# EAGLE schematic booz_main (EAGLE 6.1)

## Sheet 1 of 3
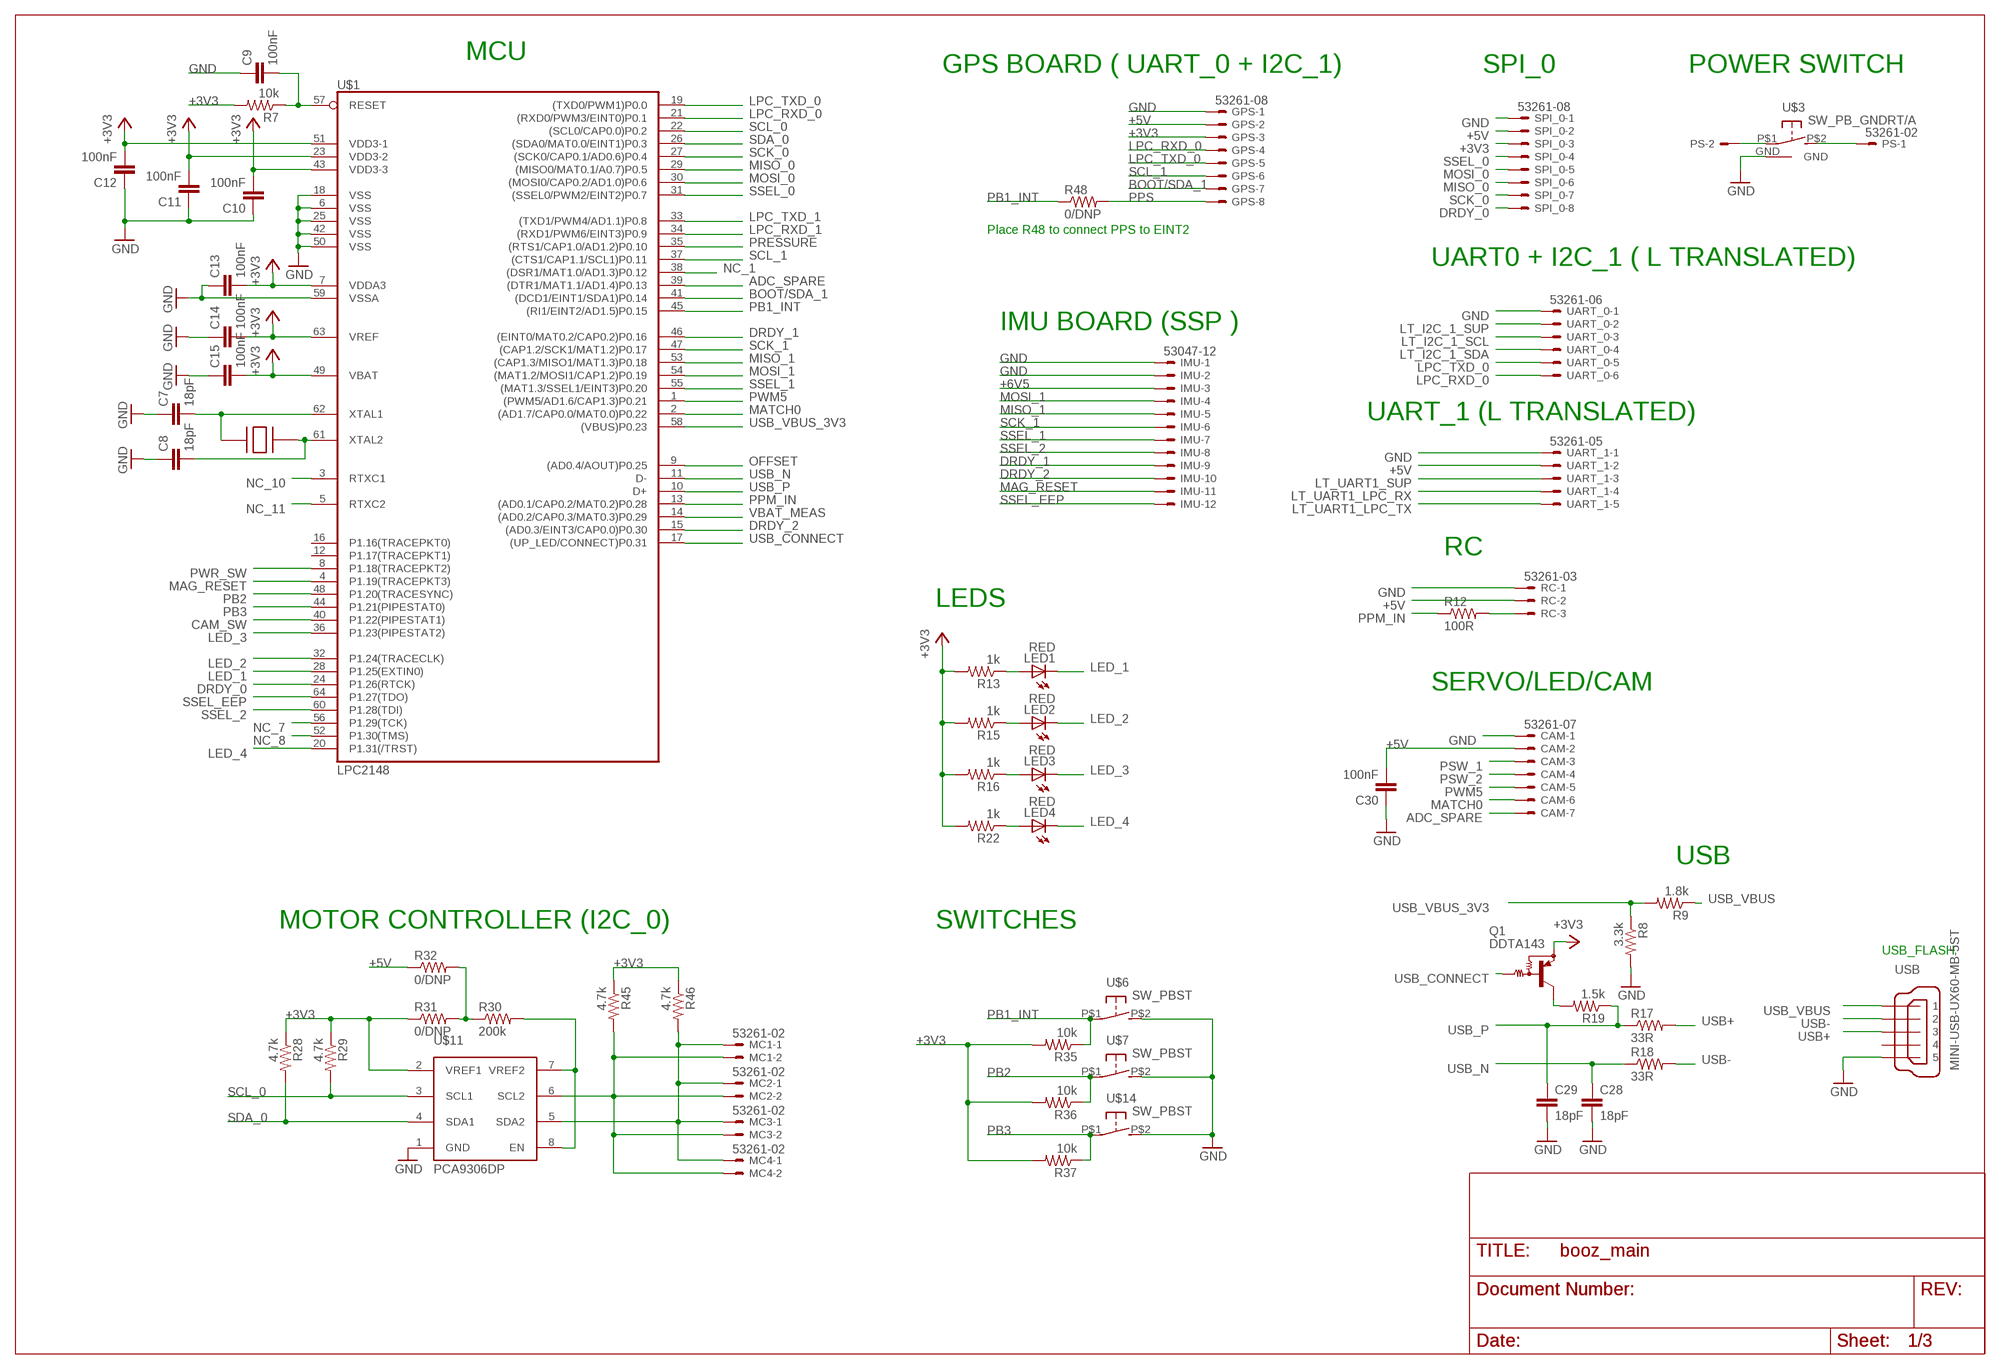
[diagram p0: schematic, sheet 1]

### Parts
C7  18pF  C-EUC0603  [C0603]
C8  18pF  C-EUC0603  [C0603]
C9  100nF  C-EUC0603  [C0603]
C10  100nF  C-EUC0603  [C0603]
C11  100nF  C-EUC0603  [C0603]
C12  100nF  C-EUC0603  [C0603]
C13  100nF  C-EUC0603  [C0603]
C14  100nF  C-EUC0603  [C0603]
C15  100nF  C-EUC0603  [C0603]
C28  18pF  C-EUC0603  [C0603]
C29  18pF  C-EUC0603  [C0603]
C30  100nF  C-EUC0603  [C0603]
CAM  53261-07  [53261-07]
GPS  53261-08  [53261-08]
IMU  53047-12  [53047-12]
LED1  RED  LEDCHIP-LED0805  [CHIP-LED0805]
LED2  RED  LEDCHIP-LED0805  [CHIP-LED0805]
LED3  RED  LEDCHIP-LED0805  [CHIP-LED0805]
LED4  RED  LEDCHIP-LED0805  [CHIP-LED0805]
MC1  53261-02  [53261-02]
MC2  53261-02  [53261-02]
MC3  53261-02  [53261-02]
MC4  53261-02  [53261-02]
PS  53261-02  [53261-02]
Q1  DDTA143  MUN2111T1  [SC59-BEC]
R7  10k  R-US_R0603  [R0603]
R8  3.3k  R-US_R0603  [R0603]
R9  1.8k  R-US_R0603  [R0603]
R12  100R  R-US_R0603  [R0603]
R13  1k  R-US_R0603  [R0603]
R15  1k  R-US_R0603  [R0603]
R16  1k  R-US_R0603  [R0603]
R17  33R  R-US_R0603  [R0603]
R18  33R  R-US_R0603  [R0603]
R19  1.5k  R-US_R0603  [R0603]
R22  1k  R-US_R0603  [R0603]
R28  4.7k  R-US_R0603  [R0603]
R29  4.7k  R-US_R0603  [R0603]
R30  200k  R-US_R0603  [R0603]
R31  0/DNP  R-US_R0603  [R0603]
R32  0/DNP  R-US_R0603  [R0603]
R35  10k  R-US_R0603  [R0603]
R36  10k  R-US_R0603  [R0603]
R37  10k  R-US_R0603  [R0603]
R45  4.7k  R-US_R0603  [R0603]
R46  4.7k  R-US_R0603  [R0603]
R48  0/DNP  R-US_R0603  [R0603]
RC  53261-03  [53261-03]
SPI_0  53261-08  [53261-08]
U$1  LPC2148  [SQFP-S-10X10-64]
U$3  SW_PB_GNDRT/A  [B3U-3100P]
U$4  CRYSTAL_CTS  [CTS_CRYSTAL]
U$6  SW_PBST  [B3U-1000P]
U$7  SW_PBST  [B3U-1000P]
U$11  PCA9306DP  [TSSOP_B3]
U$14  SW_PBST  [B3U-1000P]
UART_0  53261-06  [53261-06]
UART_1  53261-05  [53261-05]
USB  MINI-USB-UX60-MB-5ST  [UX60-MB-5ST]

### Nets
+3V3: C10.2 C11.2 C12.2 C13.2 C14.2 C15.2 GPS.3 Q1.E R7.2 R13.2 R15.2 R16.2 R22.2 R28.1 R29.1 R31.1 R35.2 R36.2 R37.2 R45.1 R46.1 SPI_0.3 U$1.7(VDDA3) U$1.23(VDD3-2) U$1.43(VDD3-3) U$1.49(VBAT) U$1.51(VDD3-1) U$1.63(VREF) U$11.2(VREF1) ; also sheet 2,3
+5V: C30.2 CAM.2 GPS.2 R32.1 RC.2 SPI_0.2 UART_1.2 ; also sheet 2,3
+6V5: IMU.3 ; also sheet 2
ADC_SPARE: CAM.7 U$1.39((DTR1/MAT1.1/AD1.4)P0.13)
BOOT/SDA_1: GPS.7 U$1.41((DCD1/EINT1/SDA1)P0.14) ; also sheet 3
CAM_SW: U$1.40(P1.22(PIPESTAT1)) ; also sheet 2
DRDY_0: SPI_0.8 U$1.24(P1.26(RTCK))
DRDY_1: IMU.9 U$1.46((EINT0/MAT0.2/CAP0.2)P0.16)
DRDY_2: IMU.10 U$1.15((AD0.3/EINT3/CAP0.0)P0.30)
GND: C7.1 C8.1 C9.1 C10.1 C11.1 C12.1 C13.1 C14.1 C15.1 C28.2 C29.2 C30.1 CAM.1 GPS.1 IMU.1 IMU.2 R8.2 RC.1 SPI_0.1 U$1.6(VSS) U$1.18(VSS) U$1.25(VSS) U$1.42(VSS) U$1.50(VSS) U$1.59(VSSA) U$3.GND U$6.P$2(S) U$7.P$2(S) U$11.1(GND) U$14.P$2(S) UART_0.1 UART_1.1 USB.5 ; also sheet 2,3
LED_1: LED1.C U$1.28(P1.25(EXTIN0))
LED_2: LED2.C U$1.32(P1.24(TRACECLK))
LED_3: LED3.C U$1.36(P1.23(PIPESTAT2))
LED_4: LED4.C U$1.20(P1.31(/TRST))
LPC_RESET: C9.2 R7.1 U$1.57(RESET)
LPC_RXD_0: GPS.4 U$1.21((RXD0/PWM3/EINT0)P0.1) UART_0.6
LPC_RXD_1: U$1.34((RXD1/PWM6/EINT3)P0.9) ; also sheet 3
LPC_TXD_0: GPS.5 U$1.19((TXD0/PWM1)P0.0) UART_0.5
LPC_TXD_1: U$1.33((TXD1/PWM4/AD1.1)P0.8) ; also sheet 3
LT_I2C_1_SCL: UART_0.3 ; also sheet 3
LT_I2C_1_SDA: UART_0.4 ; also sheet 3
LT_I2C_1_SUP: UART_0.2 ; also sheet 3
LT_UART1_LPC_RX: UART_1.4 ; also sheet 3
LT_UART1_LPC_TX: UART_1.5 ; also sheet 3
LT_UART1_SUP: UART_1.3 ; also sheet 3
MAG_RESET: IMU.11 U$1.4(P1.19(TRACEPKT3))
MATCH0: CAM.6 U$1.2((AD1.7/CAP0.0/MAT0.0)P0.22)
MISO_0: SPI_0.6 U$1.29((MISO0/MAT0.1/A0.7)P0.5)
MISO_1: IMU.5 U$1.53((CAP1.3/MISO1/MAT1.3)P0.18)
MOSI_0: SPI_0.5 U$1.30((MOSI0/CAP0.2/AD1.0)P0.6)
MOSI_1: IMU.4 U$1.54((MAT1.2/MOSI1/CAP1.2)P0.19)
N$1: LED1.A R13.1
N$2: C7.2 U$1.62(XTAL1) U$4.P$1
N$3: R30.1 R31.2 R32.2
N$4: C8.2 U$1.61(XTAL2) U$4.P$3
N$6: LED2.A R15.1
N$7: LED3.A R16.1
N$11: R30.2 U$11.7(VREF2) U$11.8(EN)
N$12: PS.2 U$3.P$1(P)
N$13: PS.1 U$3.P$2(S)
N$14: Q1.C R19.2
N$15: R12.2 RC.3
N$16: LED4.A R22.1
NC_1: U$1.38((DSR1/MAT1.0/AD1.3)P0.12)
NC_7: U$1.56(P1.29(TCK))
NC_8: U$1.52(P1.30(TMS))
NC_10: U$1.3(RTXC1)
NC_11: U$1.5(RTXC2)
OFFSET: U$1.9((AD0.4/AOUT)P0.25) ; also sheet 3
PB1_INT: R35.1 R48.1 U$1.45((RI1/EINT2/AD1.5)P0.15) U$6.P$1(P)
PB2: R36.1 U$1.48(P1.20(TRACESYNC)) U$7.P$1(P)
PB3: R37.1 U$1.44(P1.21(PIPESTAT0)) U$14.P$1(P)
PPM_IN: R12.1 U$1.13((AD0.1/CAP0.2/MAT0.2)P0.28)
PPS: GPS.8 R48.2
PRESSURE: U$1.35((RTS1/CAP1.0/AD1.2)P0.10) ; also sheet 3
PSW_1: CAM.3 ; also sheet 2
PSW_2: CAM.4 ; also sheet 2
PWM5: CAM.5 U$1.1((PWM5/AD1.6/CAP1.3)P0.21)
PWR_SW: U$1.8(P1.18(TRACEPKT2)) ; also sheet 2
SCK_0: SPI_0.7 U$1.27((SCK0/CAP0.1/AD0.6)P0.4)
SCK_1: IMU.6 U$1.47((CAP1.2/SCK1/MAT1.2)P0.17)
SCL_0: R29.2 U$1.22((SCL0/CAP0.0)P0.2) U$11.3(SCL1)
SCL_0_TRANSLATED: MC1.2 MC2.2 MC3.2 MC4.2 R45.2 U$11.6(SCL2)
SCL_1: GPS.6 U$1.37((CTS1/CAP1.1/SCL1)P0.11) ; also sheet 3
SDA_0: R28.2 U$1.26((SDA0/MAT0.0/EINT1)P0.3) U$11.4(SDA1)
SDA_0_TRANSLATED: MC1.1 MC2.1 MC3.1 MC4.1 R46.2 U$11.5(SDA2)
SSEL_0: SPI_0.4 U$1.31((SSEL0/PWM2/EINT2)P0.7)
SSEL_1: IMU.7 U$1.55((MAT1.3/SSEL1/EINT3)P0.20)
SSEL_2: IMU.8 U$1.60(P1.28(TDI))
SSEL_EEP: IMU.12 U$1.64(P1.27(TDO))
USB+: R17.2 USB.3
USB-: R18.2 USB.2
USB_CONNECT: Q1.B U$1.17((UP_LED/CONNECT)P0.31)
USB_N: C28.1 R18.1 U$1.11(D-)
USB_P: C29.1 R17.1 R19.1 U$1.10(D+)
USB_VBUS: R9.1 USB.1
USB_VBUS_3V3: R8.1 R9.2 U$1.58((VBUS)P0.23)
VBAT_MEAS: U$1.14((AD0.2/CAP0.3/MAT0.3)P0.29) ; also sheet 2
Unconnected: U$1.12(P1.17(TRACEPKT1)) U$1.16(P1.16(TRACEPKT0)) USB.4

### Notes on the sheet
- MCU
- GPS BOARD ( UART_0 + I2C_1) | SPI_0 | POWER SWITCH
- Place R48 to connect PPS to EINT2
- UART0 + I2C_1 ( L TRANSLATED)
- IMU BOARD (SSP )
- UART_1 (L TRANSLATED)
- RC
- LEDS
- SERVO/LED/CAM
- USB
- MOTOR CONTROLLER (I2C_0) | SWITCHES
- USB_FLASH

## Sheet 2 of 3
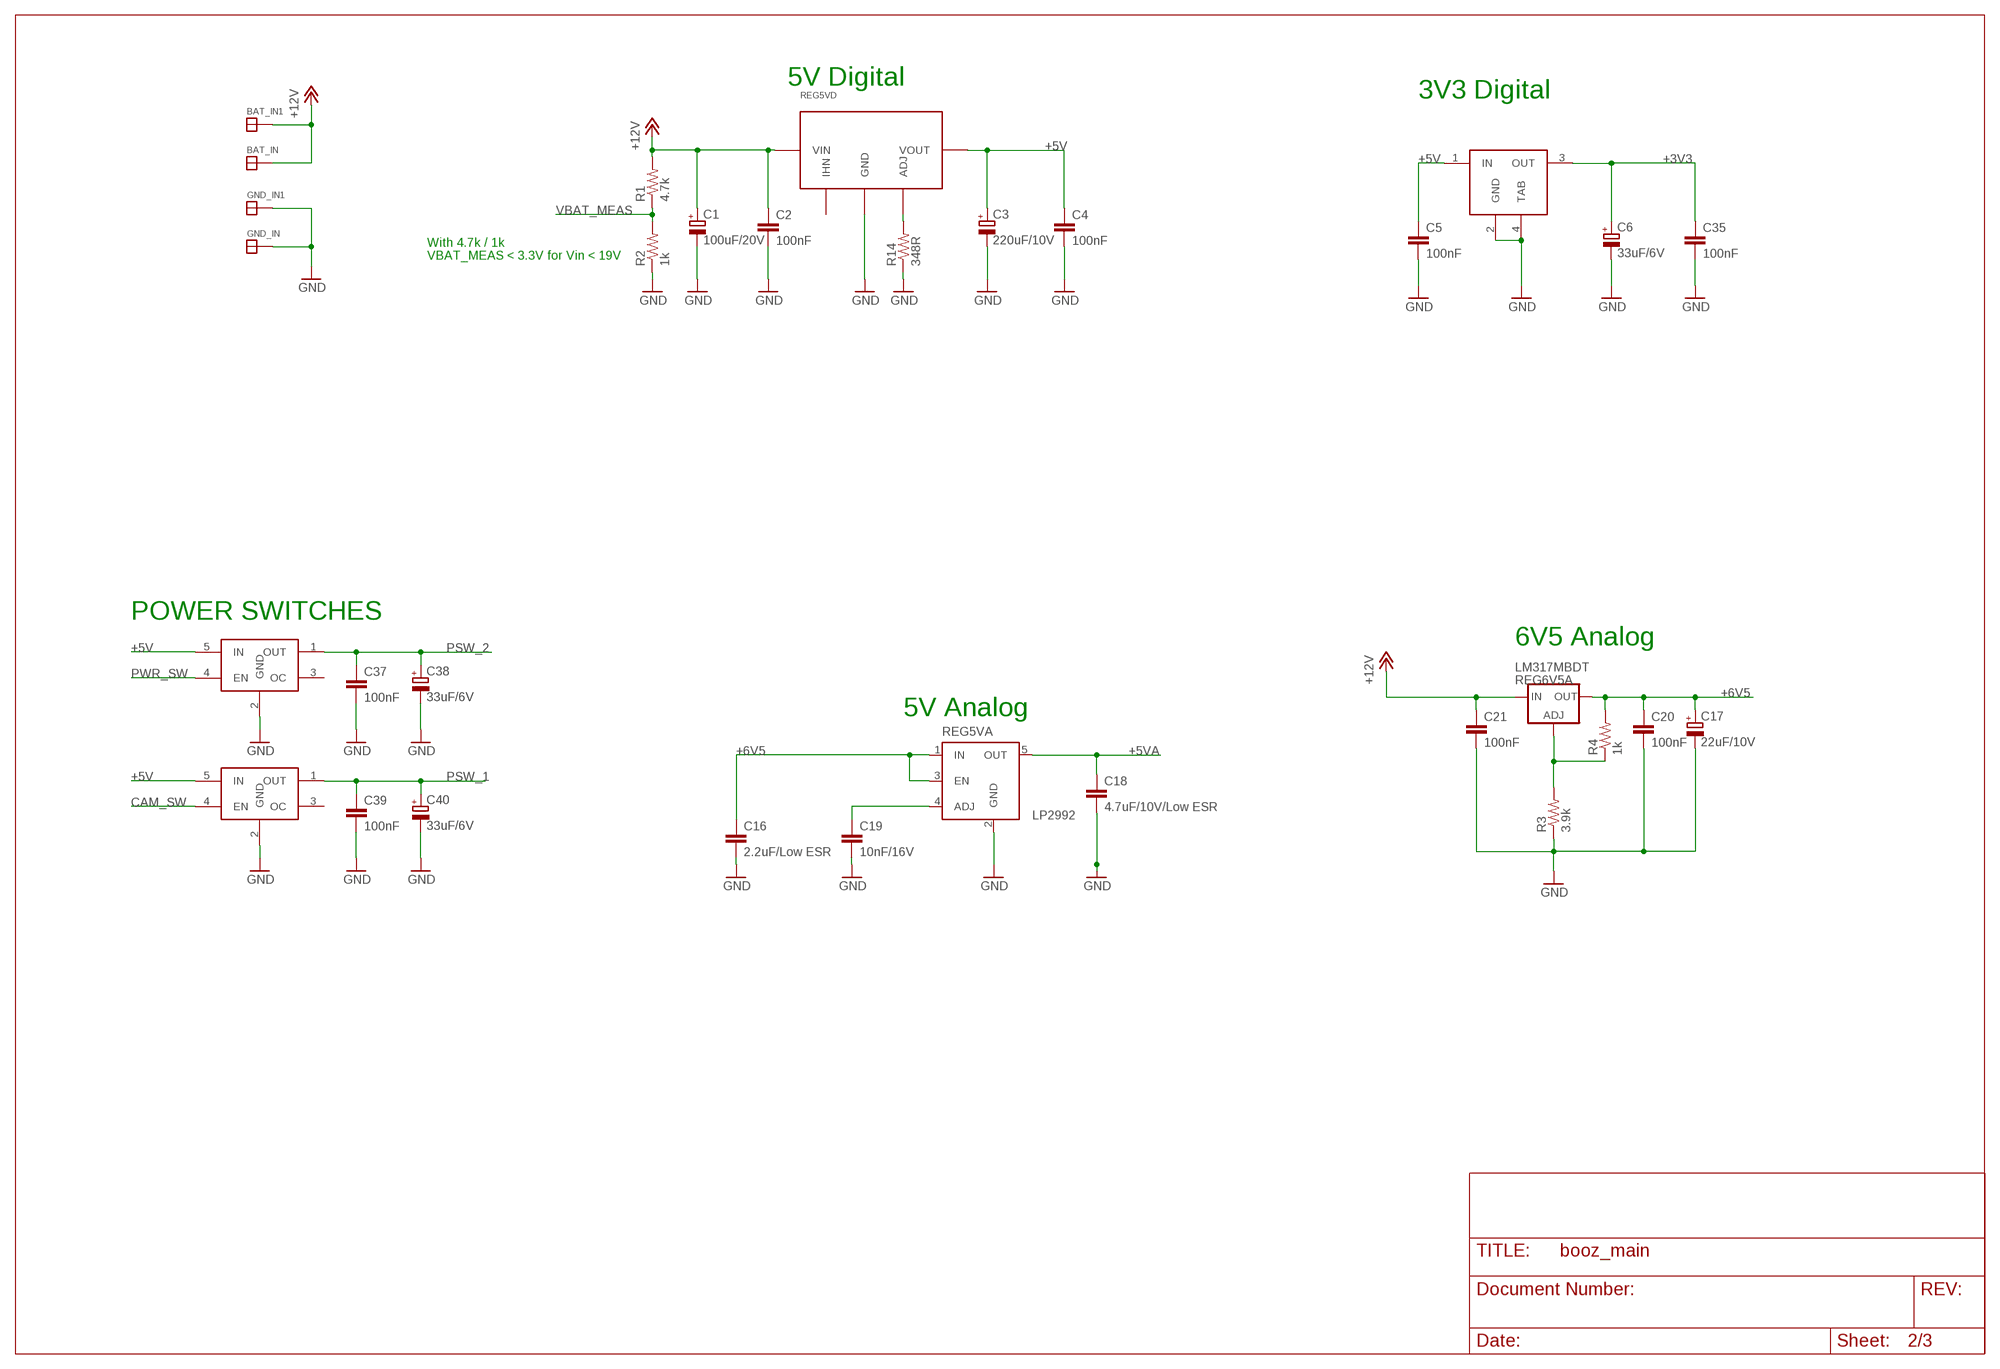
[diagram p1: schematic, sheet 2]

### Parts
BAT_IN  SOLDER_PAD150_75  [SOLD_PAD_150_75]
BAT_IN1  SOLDER_PAD150_75  [SOLD_PAD_150_75]
C1  100uF/20V  CPOL-EUSMCD  [SMC_D]
C2  100nF  C-EUC0603  [C0603]
C3  220uF/10V  CPOL-EUSMCD  [SMC_D]
C4  100nF  C-EUC0603  [C0603]
C5  100nF  C-EUC0603  [C0603]
C6  33uF/6V  CPOL-EUCT3216  [CT3216]
C16  2.2uF/Low ESR  C-EUC0603  [C0603]
C17  22uF/10V  CPOL-EUCT3216  [CT3216]
C18  4.7uF/10V/Low ESR  C-EUC0805K  [C0805K]
C19  10nF/16V  C-EUC0603K  [C0603K]
C20  100nF  C-EUC0603  [C0603]
C21  100nF  C-EUC0603  [C0603]
C35  100nF  C-EUC0603  [C0603]
C37  100nF  C-EUC0603  [C0603]
C38  33uF/6V  CPOL-EUCT3216  [CT3216]
C39  100nF  C-EUC0603  [C0603]
C40  33uF/6V  CPOL-EUCT3216  [CT3216]
GND_IN  SOLDER_PAD150_75  [SOLD_PAD_150_75]
GND_IN1  SOLDER_PAD150_75  [SOLD_PAD_150_75]
R1  4.7k  R-US_R0603  [R0603]
R2  1k  R-US_R0603  [R0603]
R3  3.9k  R-US_R0603  [R0603]
R4  1k  R-US_R0603  [R0603]
R14  348R  R-US_R0603  [R0603]
REG3V3D  LM3940IMP-3.3  [SOT223-R]
REG5VA  LP2992  MIC5219BM5  [SOT23-5]
REG5VD  PTHTH  [PTH_TH]
REG6V5A  LM317MBDT  [DPACK]
U$12  TPS2051B  [SOT23-5L]
U$13  TPS2051B  [SOT23-5L]

### Nets
+3V3: C6.+ C35.1 REG3V3D.3(OUT) ; also sheet 1,3
+5V: C3.+ C4.1 C5.1 REG3V3D.1(IN) REG5VD.P$3(VOUT) U$12.5(IN) U$13.5(IN) ; also sheet 1,3
+5VA: C18.1 REG5VA.5(OUT) ; also sheet 3
+6V5: C16.1 C17.+ C20.1 R4.2 REG5VA.1(IN) REG5VA.3(EN) REG6V5A.4(OUT) ; also sheet 1
+12V: BAT_IN1.P$1 BAT_IN.P$1 C1.+ C2.1 C21.1 R1.2 REG5VD.P$1(VIN) REG6V5A.3(IN)
CAM_SW: U$13.4(EN) ; also sheet 1
GND: C1.- C2.2 C3.- C4.2 C5.2 C6.- C16.2 C17.- C18.2 C19.2 C20.2 C21.2 C35.2 C37.2 C38.- C39.2 C40.- GND_IN1.P$1 GND_IN.P$1 R2.1 R3.1 R14.1 REG3V3D.2(GND) REG3V3D.4(TAB) REG5VA.2(GND) REG5VD.P$2(GND) U$12.2(GND) U$13.2(GND) ; also sheet 1,3
N$5: R14.2 REG5VD.P$4(ADJ)
N$23: C19.1 REG5VA.4(ADJ)
N$33: R3.2 R4.1 REG6V5A.1(ADJ)
PSW_1: C39.1 C40.+ U$13.1(OUT) ; also sheet 1
PSW_2: C37.1 C38.+ U$12.1(OUT) ; also sheet 1
PWR_SW: U$12.4(EN) ; also sheet 1
VBAT_MEAS: R1.1 R2.2 ; also sheet 1
Unconnected: REG5VD.P$5(IHN) U$12.3(OC) U$13.3(OC)

### Notes on the sheet
- 5V Digital
- 3V3 Digital
- With 4.7k / 1k
- VBAT_MEAS < 3.3V for Vin < 19V
- POWER SWITCHES
- 6V5 Analog
- 5V Analog

## Sheet 3 of 3
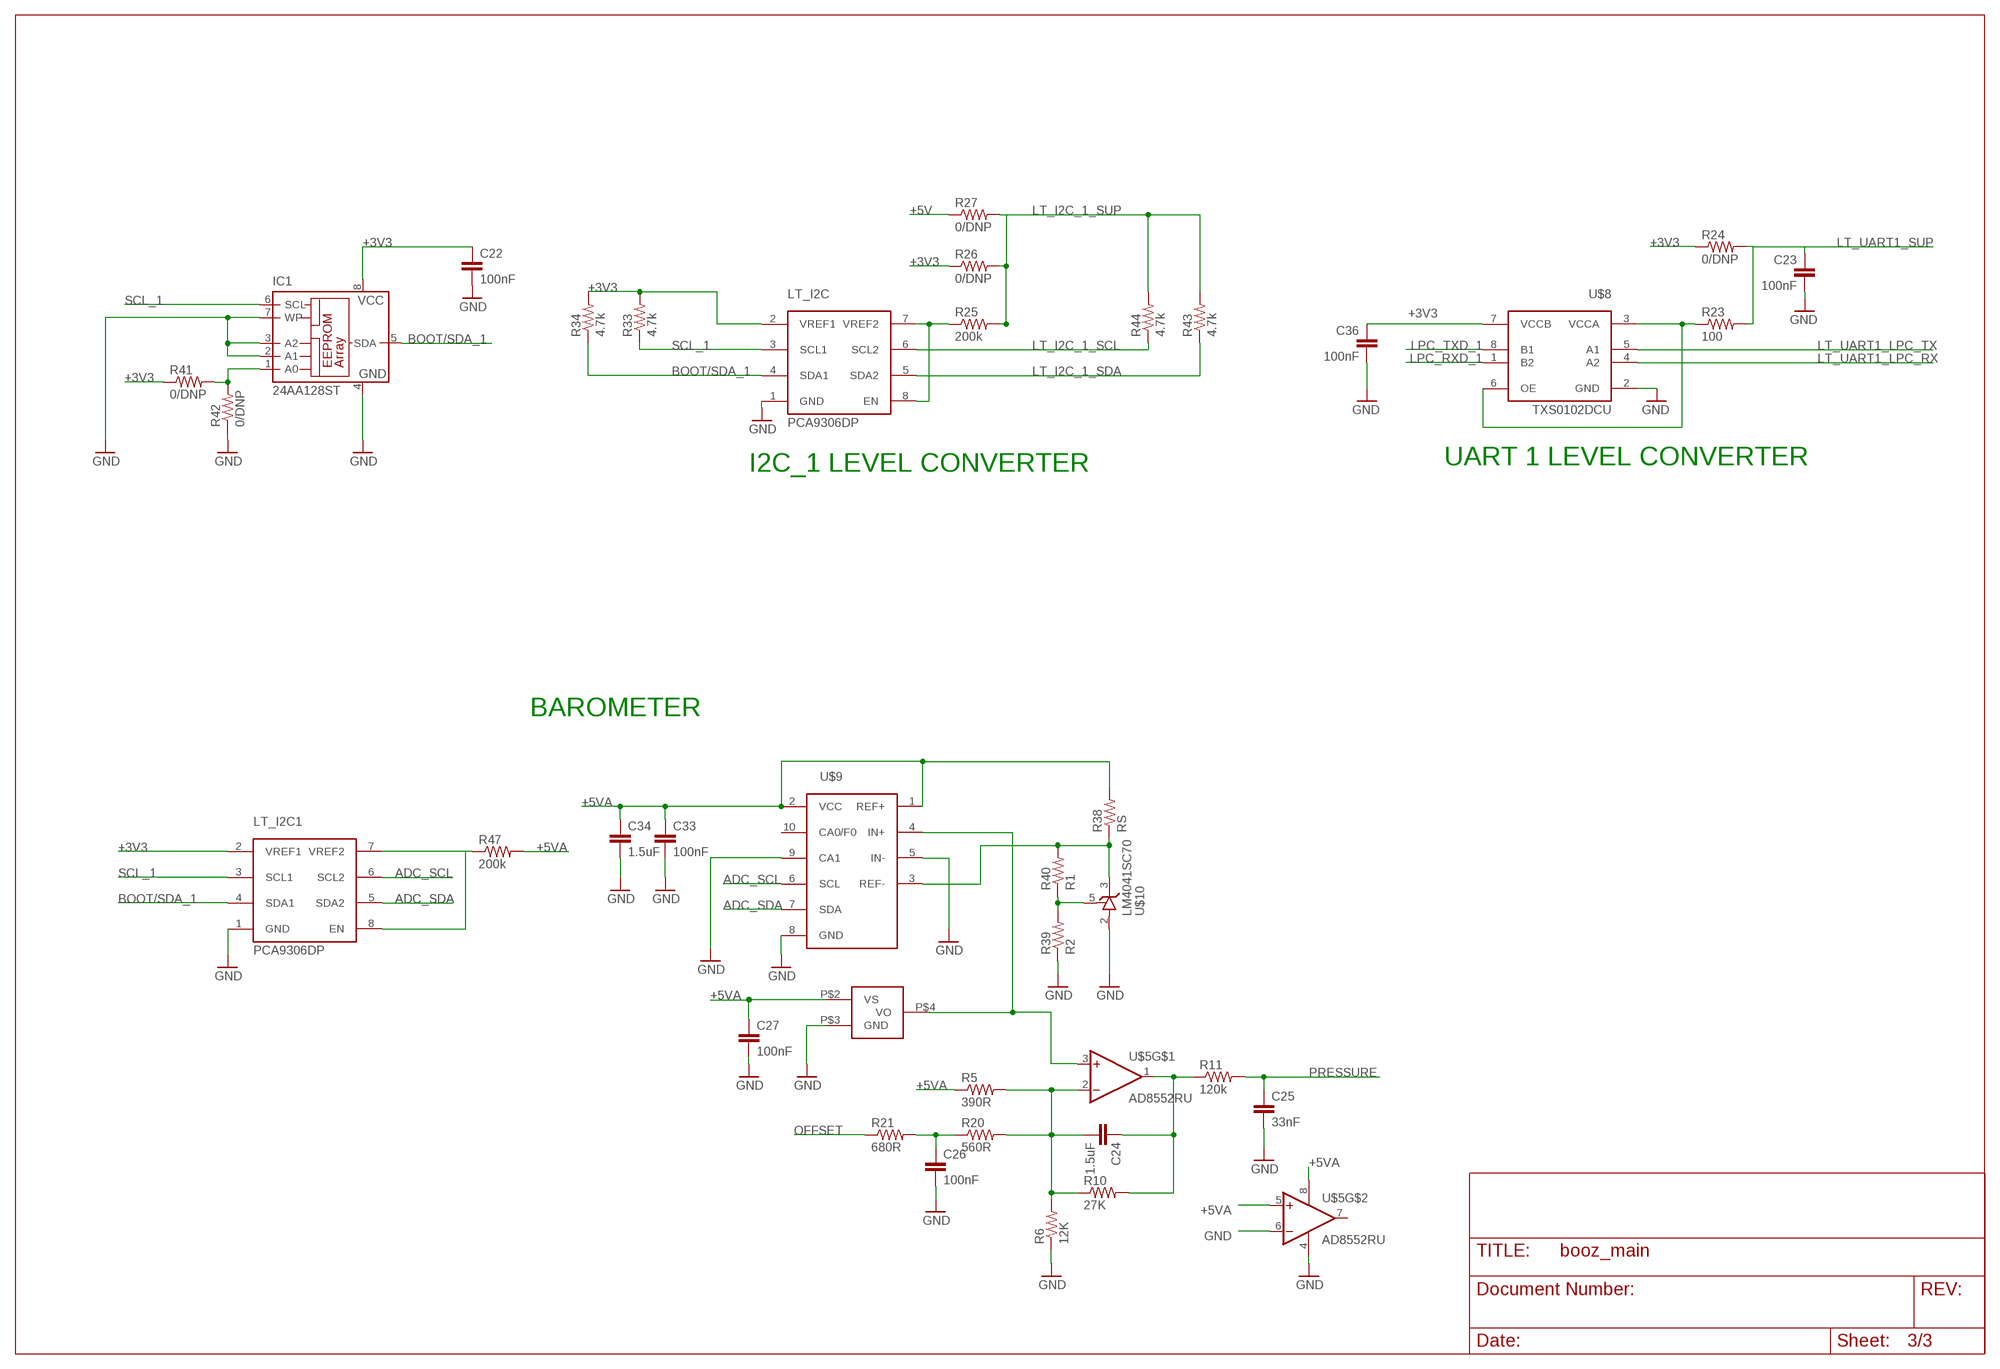
[diagram p2: schematic, sheet 3]

### Parts
C22  100nF  C-EUC0603  [C0603]
C23  100nF  C-EUC0603  [C0603]
C24  1.5uF  C-EUC0805  [C0805]
C25  33nF  C-EUC0805K  [C0805K]
C26  100nF  C-EUC0603  [C0603]
C27  100nF  C-EUC0603  [C0603]
C33  100nF  C-EUC0603  [C0603]
C34  1.5uF  C-EUC0805  [C0805]
C36  100nF  C-EUC0603  [C0603]
IC1  24AA128ST  [TSSOP8]
LT_I2C  PCA9306DP  [TSSOP_B3]
LT_I2C1  PCA9306DP  [TSSOP_B3]
R5  390R  R-US_R0603  [R0603]
R6  12K  R-US_R0603  [R0603]
R10  27K  R-US_R0603  [R0603]
R11  120k  R-US_R0603  [R0603]
R20  560R  R-US_R0603  [R0603]
R21  680R  R-US_R0603  [R0603]
R23  100  R-US_R0603  [R0603]
R24  0/DNP  R-US_R0603  [R0603]
R25  200k  R-US_R0603  [R0603]
R26  0/DNP  R-US_R0603  [R0603]
R27  0/DNP  R-US_R0603  [R0603]
R33  4.7k  R-US_R0603  [R0603]
R34  4.7k  R-US_R0603  [R0603]
R38  RS  R-US_R0603  [R0603]
R39  R2  R-US_R0603  [R0603]
R40  R1  R-US_R0603  [R0603]
R41  0/DNP  R-US_R0603  [R0603]
R42  0/DNP  R-US_R0603  [R0603]
R43  4.7k  R-US_R0603  [R0603]
R44  4.7k  R-US_R0603  [R0603]
R47  200k  R-US_R0603  [R0603]
U$2  MPX6115  [CASE_1317]
U$5  AD8552RU  [TSSOP8]
U$8  TXS0102DCU  [US8]
U$9  LTC2485  [DFN10]
U$10  LM4041SC70  [SC70-5L]

### Nets
+3V3: C22.1 C36.1 IC1.8(VCC) LT_I2C1.2(VREF1) LT_I2C.2(VREF1) R24.1 R26.1 R33.2 R34.2 R41.1 U$8.7(VCCB) ; also sheet 1,2
+5V: R27.1 ; also sheet 1,2
+5VA: C27.1 C33.1 C34.1 R5.1 R38.2 R47.2 U$2.P$2(VS) U$5.5(+IN) U$5.8(V+) U$9.1(REF+) U$9.2(VCC) ; also sheet 2
ADC_SCL: LT_I2C1.6(SCL2) U$9.6(SCL)
ADC_SDA: LT_I2C1.5(SDA2) U$9.7(SDA)
BOOT/SDA_1: IC1.5(SDA) LT_I2C1.4(SDA1) LT_I2C.4(SDA1) R34.1 ; also sheet 1
GND: C22.2 C23.2 C25.2 C26.2 C27.2 C33.2 C34.2 C36.2 IC1.2(A1) IC1.3(A2) IC1.4(GND) IC1.7(WP) LT_I2C1.1(GND) LT_I2C.1(GND) R6.1 R39.1 R42.1 U$2.P$3(GND) U$5.4(V-) U$5.6(-IN) U$8.2(GND) U$9.5(IN-) U$9.8(GND) U$9.9(CA1) U$10.2(A) ; also sheet 1,2
LPC_RXD_1: U$8.1(B2) ; also sheet 1
LPC_TXD_1: U$8.8(B1) ; also sheet 1
LT_I2C_1_SCL: LT_I2C.6(SCL2) R44.1 ; also sheet 1
LT_I2C_1_SDA: LT_I2C.5(SDA2) R43.1 ; also sheet 1
LT_I2C_1_SUP: R25.2 R26.2 R27.2 R43.2 R44.2 ; also sheet 1
LT_UART1_LPC_RX: U$8.4(A2) ; also sheet 1
LT_UART1_LPC_TX: U$8.5(A1) ; also sheet 1
LT_UART1_SUP: C23.1 R23.2 R24.2 ; also sheet 1
N$8: C24.2 R5.2 R6.2 R10.1 R20.2 U$5.2(-IN)
N$9: C24.1 R10.2 R11.1 U$5.1(OUT)
N$10: C26.1 R20.1 R21.2
N$17: R23.1 U$8.3(VCCA) U$8.6(OE)
N$18: R39.2 R40.1 U$10.5(R)
N$20: LT_I2C.7(VREF2) LT_I2C.8(EN) R25.1
N$21: IC1.1(A0) R41.2 R42.2
N$22: LT_I2C1.7(VREF2) LT_I2C1.8(EN) R47.1
N$27: R38.1 R40.2 U$9.3(REF-) U$10.3(C)
OFFSET: R21.1 ; also sheet 1
PRESSURE: C25.1 R11.2 ; also sheet 1
PRESSURE_RAW: U$2.P$4(VO) U$5.3(+IN) U$9.4(IN+)
SCL_1: IC1.6(SCL) LT_I2C1.3(SCL1) LT_I2C.3(SCL1) R33.1 ; also sheet 1
Unconnected: U$5.7(OUT) U$9.10(CA0/F0)

### Notes on the sheet
- I2C_1 LEVEL CONVERTER | UART 1 LEVEL CONVERTER
- BAROMETER

## Library data of the parts
BAT_IN BAT_IN1 GND_IN GND_IN1 = paparazzi:SOLDER_PAD
C1 C3 C6 C17 C38 C40 = rcl:CPOL-EU: POLARIZED CAPACITOR, European symbol
C2 C4 C5 C7-C16 C18-C30 C33-C37 C39 = rcl:C-EU: CAPACITOR, European symbol
CAM = con-molex:53?-07: CONNECTOR wire to board 1.25 mm (.049 inch) pitch header
GPS SPI_0 = con-molex:53?-08: CONNECTOR wire to board 1.25 mm (.049 inch) pitch header
IC1 = microchip:24*: Serial EEPROM I2C
IMU = con-molex:53?-12: CONNECTOR wire to board 1.25 mm (.049 inch) pitch header
LED1-LED4 = led:LED: LED OSRAM: - CHIPLED LG R971, LG N971, LY N971, LG Q971, LY Q971, LO R971, LY R971 LH N974, LH R974 LS Q976, LO Q976, LY Q976 LO Q996 - Hyper CHIPLED LW Q18S LB Q993, LB Q99A, LB R99A - SideLED LS A670, LO A670, LY A670, LG A670, LP A670 LB A673, LV A673, LT A673, LW A673 LH A674 LY A675 LS A676, LA A676, LO A676, LY A676, LW A676 LS A679, LY A679, LG A679 - Hyper Micro SIDELED® LS Y876, LA Y876, LO Y876, LY Y876 LT Y87S - SmartLED LW L88C, LW L88S LB L89C, LB L89S, LG L890 LS L89K, LO L89K, LY L89K LS L896, LA L896, LO L896, LY L896 - TOPLED LS T670, LO T670, LY T670, LG T670, LP T670 LSG T670, LSP T670, LSY T670, LOP T670, LYG T670 LG T671, LOG T671, LSG T671 LB T673, LV T673, LT T673, LW T673 LH T674 LS T676, LA T676, LO T676, LY T676, LB T676, LH T676, LSB T676, LW T676 LB T67C, LV T67C, LT T67C, LS T67K, LO T67K, LY T67K, LW E67C LS E67B, LA E67B, LO E67B, LY E67B, LB E67C, LV E67C, LT E67C LW T67C LS T679, LY T679, LG T679 LS T770, LO T770, LY T770, LG T770, LP T770 LB T773, LV T773, LT T773, LW T773 LH T774 LS E675, LA E675, LY E675, LS T675 LS T776, LA T776, LO T776, LY T776, LB T776 LHGB T686 LT T68C, LB T68C - Hyper Mini TOPLED® LB M676 - Mini TOPLED Santana® LG M470 LS M47K, LO M47K, LY M47K Source: http://www.osram.convergy.de - LUMILED® LXK2-PW12-R00, LXK2-PW12-S00, LXK2-PW14-U00, LXK2-PW14-V00 LXK2-PM12-R00, LXK2-PM12-S00, LXK2-PM14-U00 LXK2-PE12-Q00, LXK2-PE12-R00, LXK2-PE12-S00, LXK2-PE14-T00, LXK2-PE14-U00 LXK2-PB12-K00, LXK2-PB12-L00, LXK2-PB12-M00, LXK2-PB14-N00, LXK2-PB14-P00, LXK2-PB14-Q00 LXK2-PR12-L00, LXK2-PR12-M00, LXK2-PR14-Q00, LXK2-PR14-R00 LXK2-PD12-Q00, LXK2-PD12-R00, LXK2-PD12-S00 LXK2-PH12-R00, LXK2-PH12-S00 LXK2-PL12-P00, LXK2-PL12-Q00, LXK2-PL12-R00 Source: www.luxeon.com
LT_I2C LT_I2C1 U$11 = booz:PCA9306: Dual bidirectional I2C-bus and SMBus voltage-level translator
MC1-MC4 PS = con-molex:53?-02: CONNECTOR wire to board 1.25 mm (.049 inch) pitch header
Q1 = transistor-pnp:MUN2111*: PNP Bias Resistor Transistor
R1-R48 = rcl:R-US_: RESISTOR, American symbol
RC = con-molex:53?-03: CONNECTOR wire to board 1.25 mm (.049 inch) pitch header
REG3V3D = paparazzi:LM3940IMP-3.3
REG5VA = v-reg-micrel:MIC5219BM5: VOLTAGE REGULATOR
REG5VD = paparazzi:PTH
REG6V5A = v-reg:LM317?*: 500 mA Adjustable Output Positive Voltage Regulator Source: http://www.onsemi.co.jp .. LM317M-D.PDF
U$1 = paparazzi:LPC2148
U$2 = booz:MPX6115
U$3 = booz:SW_PB_GND
U$4 = paparazzi:CRYSTAL_CTS
U$5 = paparazzi:AD8552: dual op amp
U$6 U$7 U$14 = booz:SW_PB
U$8 = booz:TXS0102: 2-Bit Bidirectional Voltage-Level Translator for Open-Drain Application
U$9 = booz:LTC2485: 24-Bit ADC With Easy Drive, Input Current Cancellation and I2C Interface
U$10 = booz:LM4041: Precision Micropower Shunt Voltage Reference
U$12 U$13 = paparazzi:TPS2051B
UART_0 = con-molex:53?-06: CONNECTOR wire to board 1.25 mm (.049 inch) pitch header
UART_1 = con-molex:53?-05: CONNECTOR wire to board 1.25 mm (.049 inch) pitch header
USB = con-hirose:MINI-USB-: MINI USB Connector Source: http://www.hirose.co.jp/cataloge_hp/e24000019.pdf